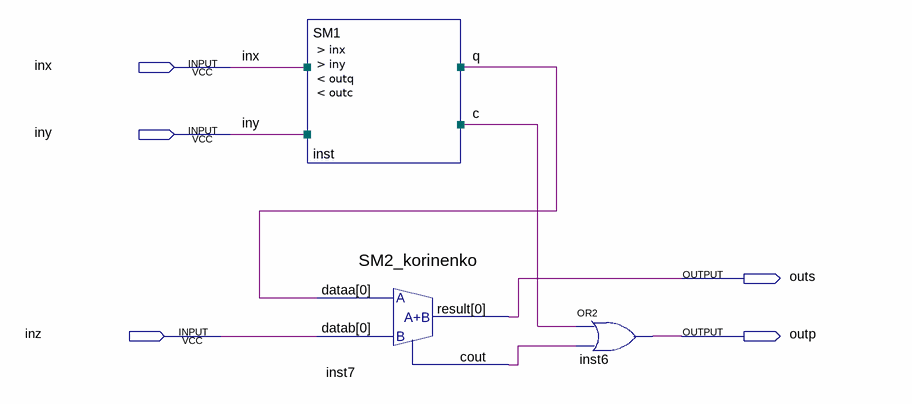
[diagram p0: schematic sheet]
// Quartus schematic Lab2_SM_korinenko.bdf as structural Verilog: 3 symbols, 5 pins
module Lab2_SM_korinenko (
  input  inx,
  input  iny,
  input  inz,
  output outs,
  output outp
);

  wire c, inst7_cout, q;

  SM1 inst (.inx(inx), .iny(iny), .outq(q), .outc(c));
  SM2_korinenko inst7 (.dataa(q), .datab(inz), .result(outs), .cout(inst7_cout));
  or inst6 (outp, c, inst7_cout);
endmodule
